# EAGLE schematic BMSv5_BatLength (EAGLE 7.6.0)

## Sheet 1 of 2
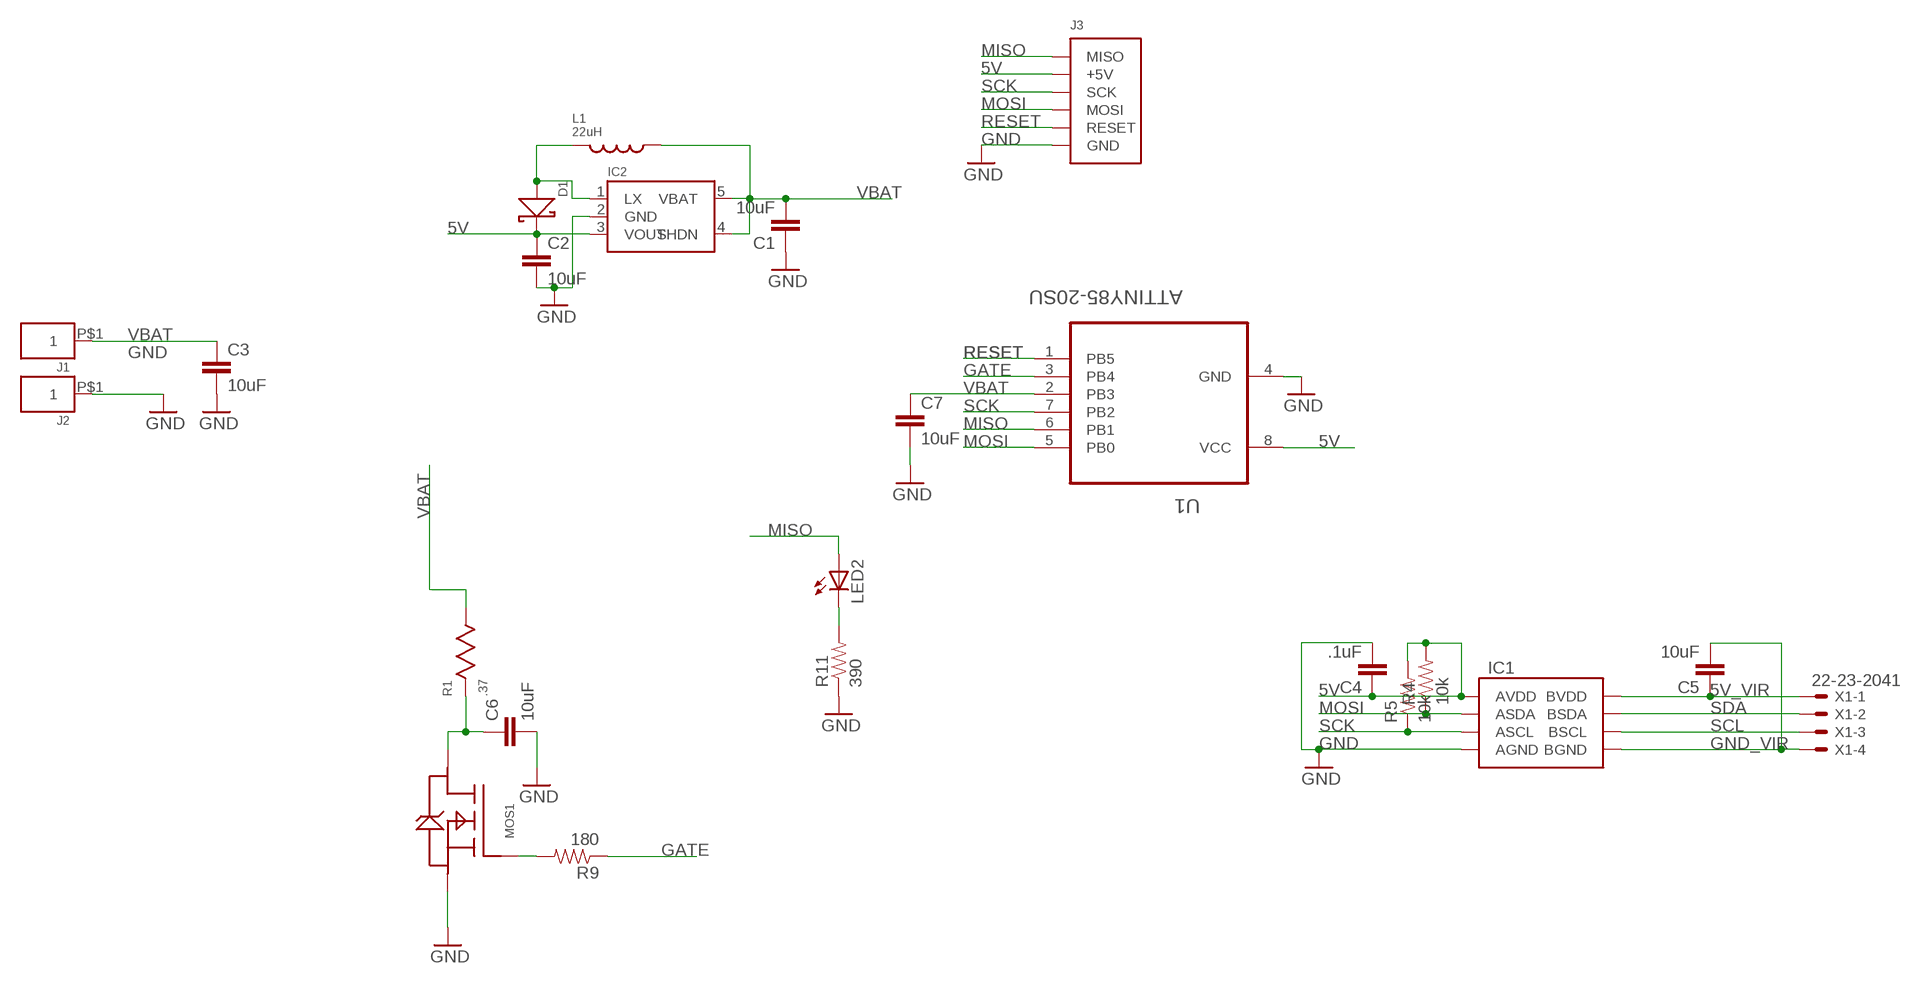
[diagram p0: schematic, sheet 1]

### Parts
C1  10uF  10UF10V10%(0805)  [0805-CAP]
C2  10uF  10UF10V10%(0805)  [0805-CAP]
C3  10uF  10UF10V10%(0805)  [0805-CAP]
C4  .1uF  10UF10V10%(0805)  [0805-CAP]
C5  10uF  10UF10V10%(0805)  [0805-CAP]
C6  10uF  10UF10V10%(0805)  [0805-CAP]
C7  10uF  10UF10V10%(0805)  [0805-CAP]
D1  DIODE_SCHOTTKYSOD-123  [SOD-123]
IC1  SI8600_DUALCHANNELISO  [SOIC-8]
IC2  SP6641  [SOT-23]
J1  CONNECTOR_1PIN  [SMD_PAD_.15X.25]
J2  CONNECTOR_1PIN  [SMD_PAD_.15X.25]
J3  ISPHEADER  [2X3PIN_.1']
L1  22uH  CHIP_IND1  [6X6MM_IND]
LED2  LEDCHIPLED_0805  [CHIPLED_0805]
MOS1  MOS_N_LOGIC_PSMN7R0  [LFPAK]
R1  .37  RES_THROUGH  [TO-220-2]
R4  10k  0.3OHM-1/8W-1%(0805)  [0805]
R5  10k  0.3OHM-1/8W-1%(0805)  [0805]
R9  180  0.3OHM-1/8W-1%(0805)  [0805]
R11  390  0.3OHM-1/8W-1%(0805)  [0805]
U1  ATTINY85-20SU  [SOIC127P798X216-8N]
X1  22-23-2041  [22-23-2041]

### Nets
5V: C2.1 C4.1 D1.CATHODE IC1.P$1(AVDD) IC2.3(VOUT) J3.P$2(+5V) R4.2 R5.2 U1.8(VCC)
5V_VIR: C5.1 IC1.P$8(BVDD) X1.1
GATE: R9.1 U1.3(PB4)
GND: C1.1 C2.2 C3.2 C4.2 C6.2 C7.2 IC1.P$4(AGND) IC2.2(GND) J2.P$1 J3.P$6(GND) MOS1.P$1(SOURCE) MOS1.P$2(SOURCE) MOS1.P$3(SOURCE) R11.1 U1.4(GND)
GND_VIR: C5.2 IC1.P$5(BGND) X1.4
MISO: J3.P$1(MISO) LED2.A U1.6(PB1)
MOSI: IC1.P$2(ASDA) J3.P$4(MOSI) R4.1 U1.5(PB0)
N$2: MOS1.P$4(GATE) R9.2
N$4: LED2.C R11.2
N$14: C6.1 MOS1.P$5(DRAIN) R1.P$1
N$29: D1.ANODE IC2.1(LX) L1.P$1
RESET: J3.P$5(RESET) U1.1(PB5)
SCK: IC1.P$3(ASCL) J3.P$3(SCK) R5.1 U1.7(PB2)
SCL: IC1.P$6(BSCL) X1.3
SDA: IC1.P$7(BSDA) X1.2
VBAT: C1.2 C3.1 C7.1 IC2.4(SHDN) IC2.5(VBAT) J1.P$1 L1.P$2 R1.P$2 U1.2(PB3)

## Sheet 2 of 2

## Library data of the parts
C1-C7 = SparkFun-Capacitors:10UF10V10%(0805): CAP-11330; PROD_ID: CAP-11330
D1 = lolomolo:DIODE_SCHOTTKY
IC1 = lolomolo:SI8600_DUALCHANNELISO
IC2 = lolomolo:SP6641
J1 J2 = lolomolo:CONNECTOR_1PIN
J3 = lolomolo:ISPHEADER
L1 = lolomolo:CHIP_IND: Chip Inductor
LED2 = adafruit:LED: LED OSRAM: - CHIPLED LG R971, LG N971, LY N971, LG Q971, LY Q971, LO R971, LY R971 LH N974, LH R974 LS Q976, LO Q976, LY Q976 LO Q996 - Hyper CHIPLED LW Q18S LB Q993, LB Q99A, LB R99A - SideLED LS A670, LO A670, LY A670, LG A670, LP A670 LB A673, LV A673, LT A673, LW A673 LH A674 LY A675 LS A676, LA A676, LO A676, LY A676, LW A676 LS A679, LY A679, LG A679 - Hyper Micro SIDELED® LS Y876, LA Y876, LO Y876, LY Y876 LT Y87S - SmartLED LW L88C, LW L88S LB L89C, LB L89S, LG L890 LS L89K, LO L89K, LY L89K LS L896, LA L896, LO L896, LY L896 - TOPLED LS T670, LO T670, LY T670, LG T670, LP T670 LSG T670, LSP T670, LSY T670, LOP T670, LYG T670 LG T671, LOG T671, LSG T671 LB T673, LV T673, LT T673, LW T673 LH T674 LS T676, LA T676, LO T676, LY T676, LB T676, LH T676, LSB T676, LW T676 LB T67C, LV T67C, LT T67C, LS T67K, LO T67K, LY T67K, LW E67C LS E67B, LA E67B, LO E67B, LY E67B, LB E67C, LV E67C, LT E67C LW T67C LS T679, LY T679, LG T679 LS T770, LO T770, LY T770, LG T770, LP T770 LB T773, LV T773, LT T773, LW T773 LH T774 LS E675, LA E675, LY E675, LS T675 LS T776, LA T776, LO T776, LY T776, LB T776 LHGB T686 LT T68C, LB T68C - Hyper Mini TOPLED® LB M676 - Mini TOPLED Santana® LG M470 LS M47K, LO M47K, LY M47K Source: http://www.osram.convergy.de/
MOS1 = lolomolo:MOS_N_LOGIC_PSMN7R0
R1 = lolomolo:RES_THROUGH
R4 R5 R9 R11 = SparkFun-Resistors:0.3OHM-1/8W-1%(0805): RES-11622; PROD_ID: RES-11622; VALUE: 0.3
U1 = Atmel_By_element14_Batch_1-00:ATTINY85-20SU: 8-bit Microcontroller with In-System Programmable Flash; MPN: ATTINY85-20SU; OC_FARNELL: 1455164; OC_NEWARK: 58M3797; PACKAGE: SOIC-8; SUPPLIER: Atmel
X1 = con-molex:22-23-2041: .100" (2.54mm) Center Header - 4 Pin; MF: MOLEX; MPN: 22-23-2041; OC_FARNELL: 1462920; OC_NEWARK: 38C0355